# EAGLE design YOTSUBA_+X_EM_ver.1.0 (EAGLE 9.6.2)
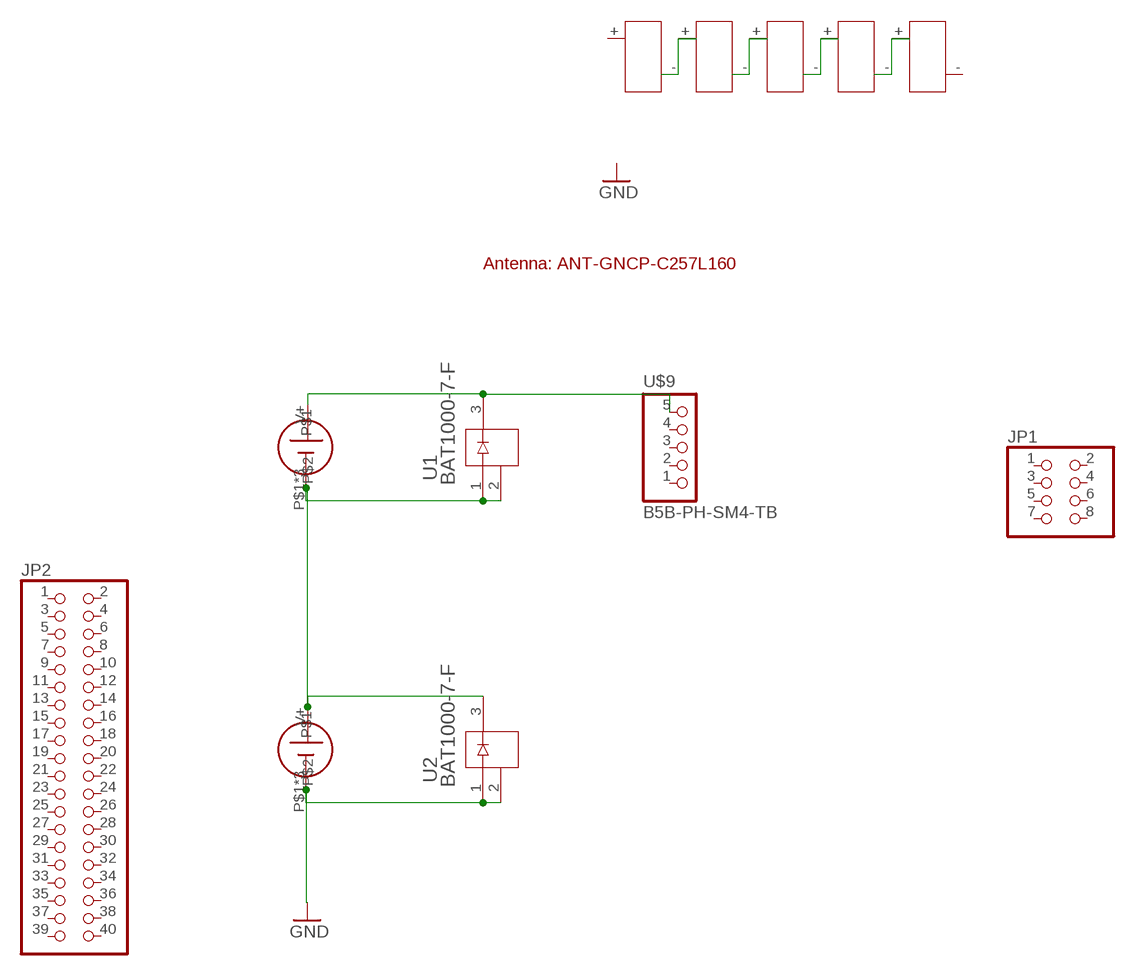
[diagram p0: schematic, sheet 1]

## Parts
JP1  PINHD-2X4  [2X04]
JP2  PINHD-2X20  [2X20]
U1  BAT1000-7-F  [SOT23_BAT_DIO]
U2  BAT1000-7-F  [SOT23_BAT_DIO]
U$1  SOLAR_2.0_SOLAR  [SOLAR_2.0_SOLAR]
U$2  ANT-GNCP-C257L160  [ANT-GNCP-C257L160]
U$3  KSP-F12  [KSP-F12]
U$4  KSP-F12  [KSP-F12]
U$5  KSP-F12  [KSP-F12]
U$6  KSP-F12  [KSP-F12]
U$7  KSP-F12  [KSP-F12]
U$8  SOLAR_2.0_SOLAR  [SOLAR_2.0_SOLAR]
U$9  B5B-PH-SM4-TB  [B5B-PH-SM4-TB]

## Nets
GND: U2.1 U2.2 U$8.P$1 U$8.P$2 U$8.P$3
N$1: U$3.- U$4.+
N$2: U$4.- U$5.+
N$3: U$5.- U$6.+
N$4: U$6.- U$7.+
N$5: U1.1 U1.2 U2.3 U$1.P$1 U$1.P$2 U$1.P$3 U$8.V+
N$6: U1.3 U$1.V+ U$9.5
Unconnected: JP1.1 JP1.2 JP1.3 JP1.4 JP1.5 JP1.6 JP1.7 JP1.8 JP2.1 JP2.2 JP2.3 JP2.4 JP2.5 JP2.6 JP2.7 JP2.8 JP2.9 JP2.10 JP2.11 JP2.12 JP2.13 JP2.14 JP2.15 JP2.16 JP2.17 JP2.18 JP2.19 JP2.20 JP2.21 JP2.22 JP2.23 JP2.24 JP2.25 JP2.26 JP2.27 JP2.28 JP2.29 JP2.30 JP2.31 JP2.32 JP2.33 JP2.34 JP2.35 JP2.36 JP2.37 JP2.38 JP2.39 JP2.40 U$3.+ U$7.- U$9.1 U$9.2 U$9.3 U$9.4

## Library data of the parts
JP1 = pinhead:PINHD-2X4: PIN HEADER
JP2 = pinhead:PINHD-2X20: PIN HEADER
U1 U2 = BAT1000:BAT1000-7-F; COPYRIGHT: Copyright (C) 2022 Ultra Librarian. All rights reserved.; MANUFACTURER_PART_NUMBER: BAT1000-7-F; MFR_NAME: Diodes Inc
U$1 U$8 = BBM_panel_base+Z ver1.0:SOLAR_2.0_SOLAR
U$2 = ANT-GNCP-C257L160:ANT-GNCP-C257L160
U$3-U$7 = KSP-F12:KSP-F12
U$9 = MITSUBA_Connectors-v4.0:B5B-PH-SM4-TB

## Board
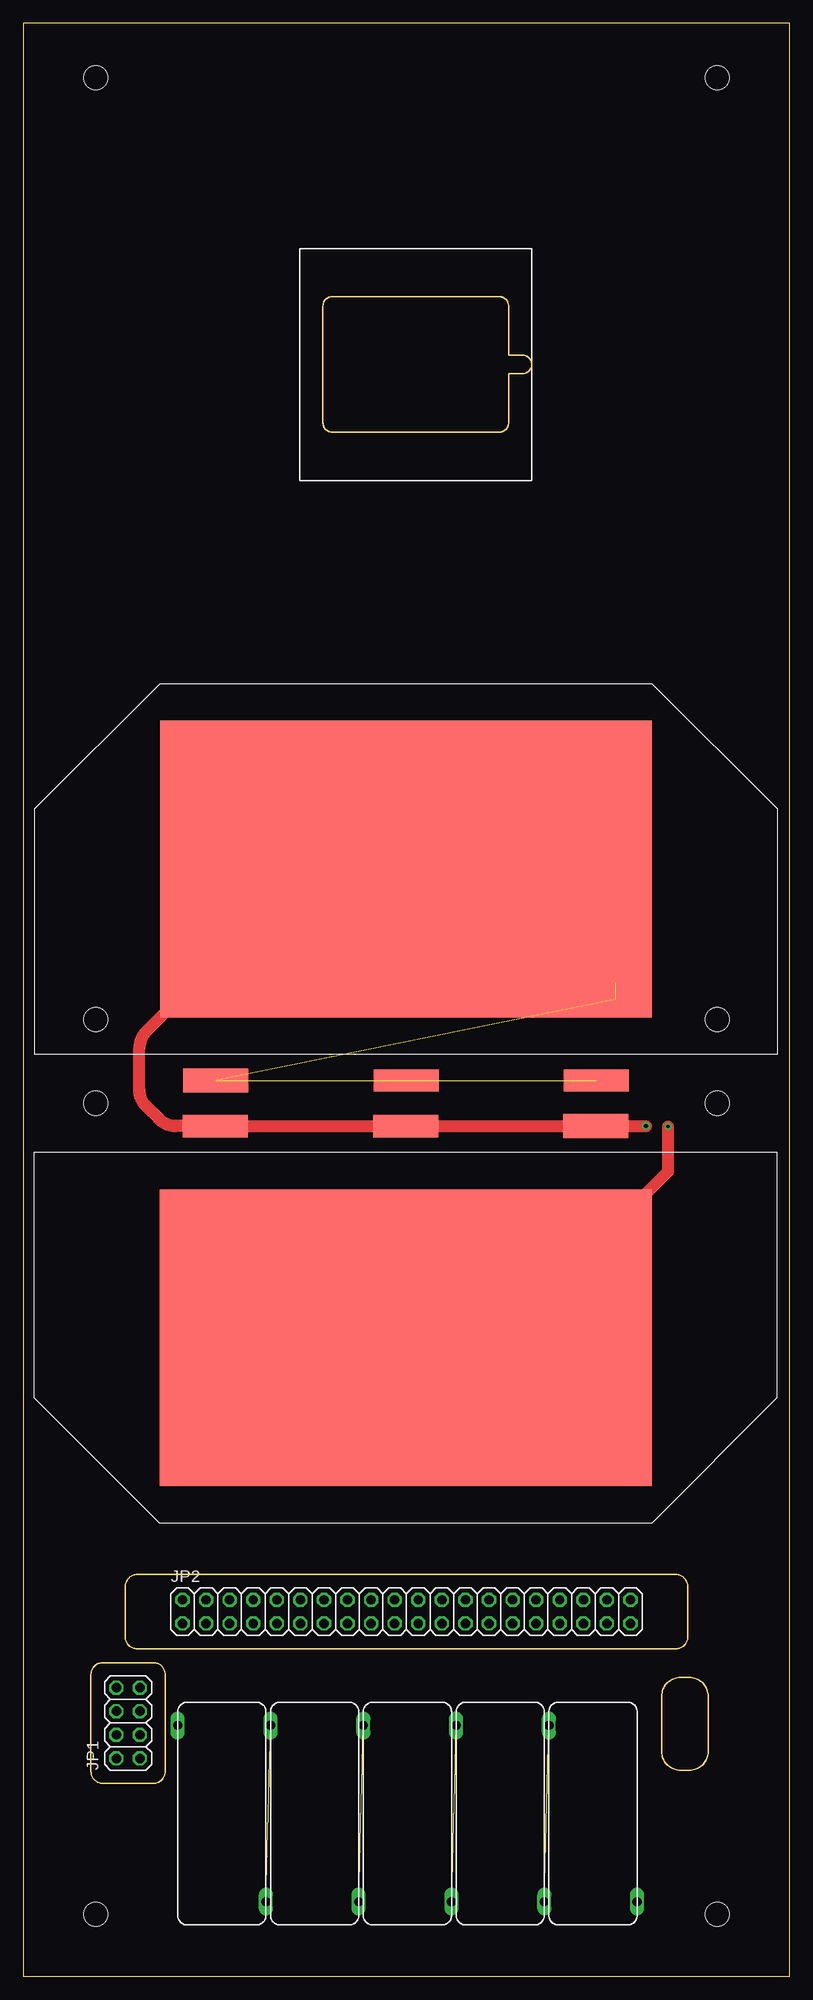
[diagram p1: board, top side]
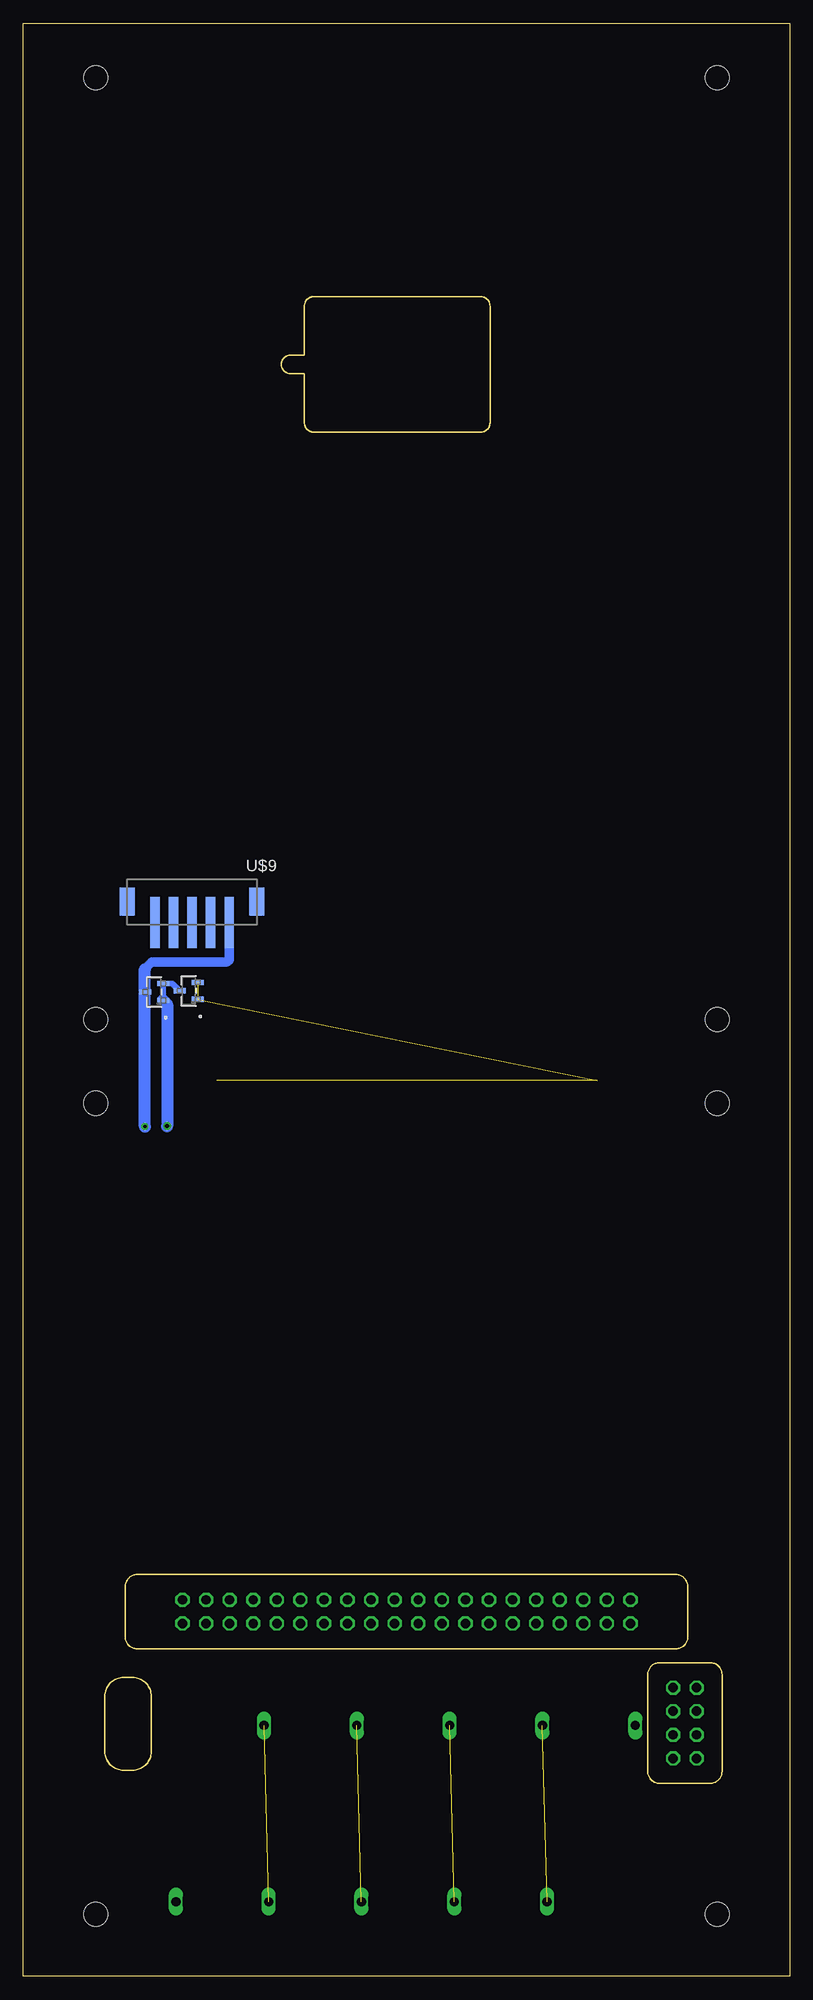
[diagram p2: board, bottom side, seen from below]

Size 82.6 x 210.5 mm. Coordinates in mm from the lower left corner, seen from the top.
Outline: 0,0 82.6,0 82.6,210.5 0,210.5 0,0
Outline: 11,42.03 11,36.57 arc90 12.27,35.3 70.33,35.3 arc90 71.6,36.57 71.6,42.03 arc90 70.33,43.3 12.27,43.3 arc90 11,42.03
Outline: 7.3,32.53 7.3,22.07 arc90 8.57,20.8 14.03,20.8 arc90 15.3,22.07 15.3,32.53 arc90 14.03,33.8 8.57,33.8 arc90 7.3,32.53
Outline: 73.8,30.21 73.8,24.21 arc-90 71.8,22.21 70.8,22.21 arc-90 68.8,24.21 68.8,30.21 arc-90 70.8,32.21 71.8,32.21 arc-90 73.8,30.21
Copper layers (1*16): Top 0.035mm / dielectric 1.5mm / Bottom 0.035mm
Design rules "default": minimum track width 6mil, minimum drill 0.35mm, track to track 6mil, track to pad 6mil, pad to pad 6mil, via to via 6mil, smd to smd 6mil, copper to edge 40mil, drill to drill 6mil, minimum pad ring 10mil, minimum via ring 8mil, stop-mask expansion 4mil, vias tented up to drill 0mil, thermal gap 10mil
Holes 2.6 mm at 7.8,6.7 74.8,6.7 7.8,204.6 74.8,204.6 74.8,103.1 7.8,94.1 74.8,94.1 7.8,103.1

### Footprints (pad centres in the part's own frame; a part is rotated, then mirrored left to right if it is on the bottom)
2X04 = drill 1.016 octagon: 1 -3.81,-1.27; 2 -3.81,1.27; 3 -1.27,-1.27; 4 -1.27,1.27; 5 1.27,-1.27; 6 1.27,1.27; 7 3.81,-1.27; 8 3.81,1.27
2X20 = drill 1.016 octagon: 1 -24.13,-1.27; 2 -24.13,1.27; 3 -21.59,-1.27; 4 -21.59,1.27; 5 -19.05,-1.27; 6 -19.05,1.27; 7 -16.51,-1.27; 8 -16.51,1.27; 9 -13.97,-1.27; 10 -13.97,1.27; 11 -11.43,-1.27; 12 -11.43,1.27; 13 -8.89,-1.27; 14 -8.89,1.27; 15 -6.35,-1.27; 16 -6.35,1.27; 17 -3.81,-1.27; 18 -3.81,1.27; 19 -1.27,-1.27; 20 -1.27,1.27; 21 1.27,-1.27; 22 1.27,1.27; 23 3.81,-1.27; 24 3.81,1.27; 25 6.35,-1.27; 26 6.35,1.27; 27 8.89,-1.27; 28 8.89,1.27; 29 11.43,-1.27; 30 11.43,1.27; 31 13.97,-1.27; 32 13.97,1.27; 33 16.51,-1.27; 34 16.51,1.27; 35 19.05,-1.27; 36 19.05,1.27; 37 21.59,-1.27; 38 21.59,1.27; 39 24.13,-1.27; 40 24.13,1.27
SOT23_BAT_DIO = smd 0.559 x 1.27: 1 -0.915,-0.965; 2 0.915,-0.965; 3 0,0.965
SOLAR_2.0_SOLAR = smd 7 x 2.6: P$1 6,-42.8 | smd 7 x 2.4: P$2 26.5,-42.8; P$3 47,-42.8 | smd 53 x 32: V+ 26.5,-20
KSP-F12 = drill 1 long: + 2.5,0; - 21.5,9.5
B5B-PH-SM4-TB = smd 1 x 5.5: 1 0,0; 2 2,0; 3 4,0; 4 6,0; 5 8,0 | smd 1.6 x 3: MP1 -2.983,2.25; MP2 10.959,2.25

### Placement (x,y rotation side)
JP1  11.3,27.3 90 top
JP2  41.3,39.3 0 top
U1  68.48,106.09 90 bottom
U2  64.76,106.21 90 bottom
U$1  67.7,48.83 180 top
U$2  42.3,173.72 0 top
U$3  66.15,5.54 90 top
U$4  56.15,5.54 90 top
U$5  46.15,5.54 90 top
U$6  36.15,5.54 90 top
U$7  26.15,5.54 90 top
U$8  14.75,139.35 0 top
U$9  68.41,113.57 0 bottom

### Tracks (layer width: path | path; a pad name or v marks a point on that pad's centre or on a via)
GND  (4 unrouted)
N$1  (1 unrouted)
N$2  (1 unrouted)
N$3  (1 unrouted)
N$4  (1 unrouted)
N$5  (via drill 0.45)
  Top 1.27: U$8.V+ 30.77,119.35 13.26,101.84 arc45 12.52,100.05 12.52,95.54 arc45 13.26,93.75 14.64,92.37 arc45 16.43,91.63 U$1.P$3 U$1.P$2 U$1.P$1 v67.1,91.63
  Bottom 0.61: U1.1 U1.2 66.52,107 U2.3
  Bottom 1.27: v67.1,91.63 v67.09,91.64 67.09,104.75 U1.1
N$6  (via drill 0.35)
  Top 1.27: U$1.V+ 51.57,68.83 69.48,86.74 v69.48,91.59
  Bottom 1.016: 69.48,108.55 68.73,109.3 60.65,109.3 60.41,109.54 U$9.5
  Bottom 1.27: 69.48,108.55 69.48,106.12 U1.3 69.48,106.06 v69.48,91.59